# Altium schematic sheet Connectors.SchDoc
size B; Organization: VITRONIC Dr.-Ing. Stein Bildverarbeitungssysteme GmbH; Address1: Hasengartenstrasse 14; Address2: D-65189 Wiesbaden; Address3: Phone: 49/611/7152-0; Address4: Fax:     49/611/7152-133; SheetNumber: 1; SheetTotal: 3
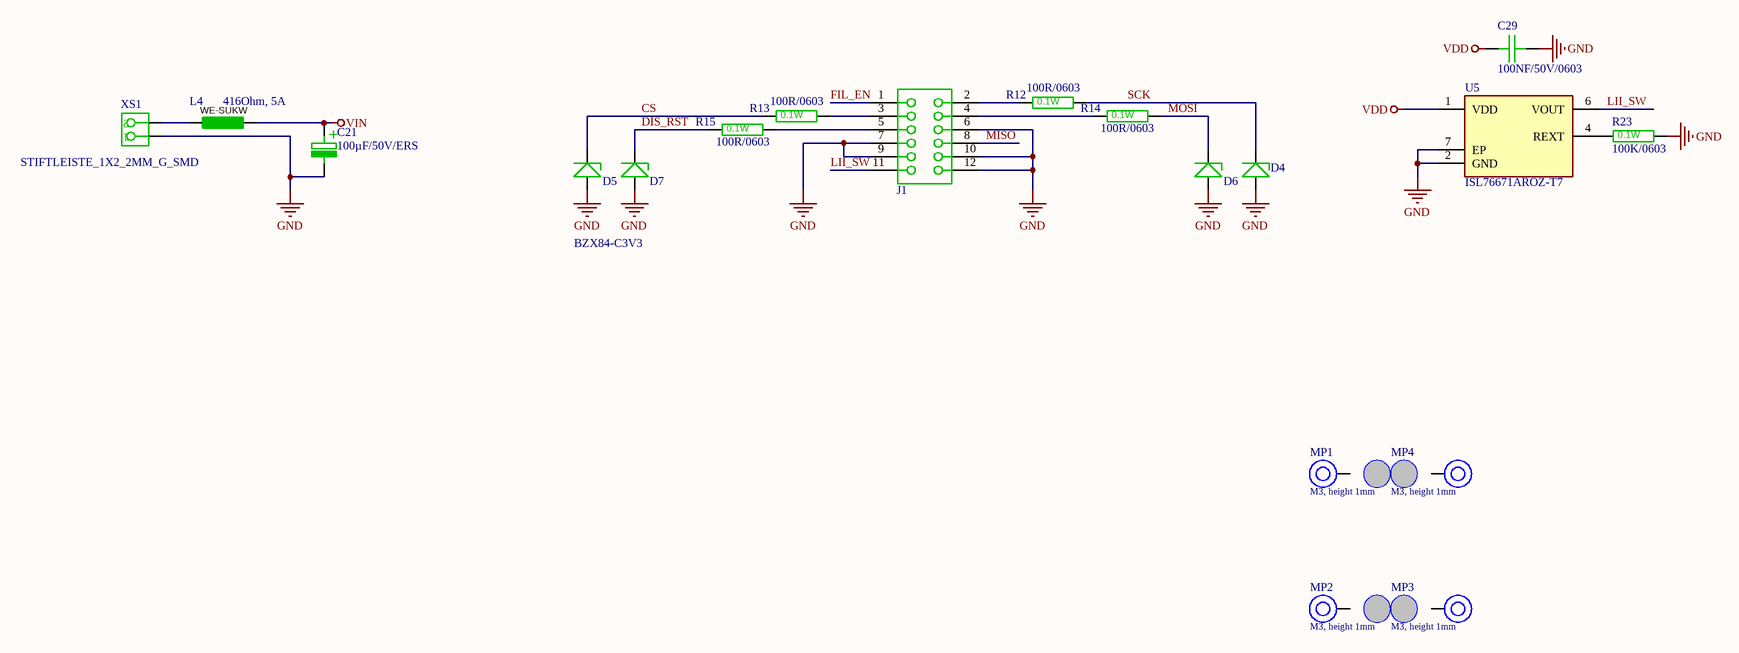
[diagram p0: Connectors.SchDoc]

## Parts
C21  100µF/50V/ERS  [AL-ERS8x8__R]
C29  100NF/50V/0603  [0603__R]
D4  BZX84-C3V3  [SOT-23-3__R]
D5  BZX84-C3V3  [SOT-23-3__R]  (value not drawn)
D6  BZX84-C3V3  [SOT-23-3__R]  (value not drawn)
D7  BZX84-C3V3  [SOT-23-3__R]  (value not drawn)
J1  490107671212  [490107671212_Permanent Application]  (value not drawn)
L4  416Ohm, 5A  [7427511_WE-SUKW__R]
MP1  M3, height 1mm  [9774010360_R]
MP2  M3, height 1mm  [9774010360_R]
MP3  M3, height 1mm  [9774010360_R]
MP4  M3, height 1mm  [9774010360_R]
R12  100R/0603  [0603__R]
R13  100R/0603  [0603__R]
R14  100R/0603  [0603__R]
R15  100R/0603  [0603__R]
R23  100K/0603  [0603__R]
U5  ISL76671AROZ-T7  [SON65P210X200X80-7N]
XS1  STIFTLEISTE_1X2_2MM_G_SMD  [1X2POL-2mm-G__R]

## Nets
GND: C21.1 C29.1 D4.1 D5.1 D6.1 D7.1 J1.6 J1.7 J1.9 J1.10 J1.12 R23.2 U5.2(GND) U5.7(EP) XS1.1
VDD: C29.2 U5.1(VDD)
VIN: C21.2 L4.2
CS: D5.3 R13.1
DIS_RST: D7.3 R15.1
FIL_EN: J1.1
LII_SW: J1.11 U5.6(VOUT)
MISO: J1.8
MOSI: D6.3 R14.2
SCK: D4.3 R12.2
NetJ1_2: J1.2 R12.1
NetJ1_3: J1.3 R13.2
NetJ1_4: J1.4 R14.1
NetJ1_5: J1.5 R15.2
NetL4_1: L4.1 XS1.2
NetR23_1: R23.1 U5.4(REXT)

Not connected (* = marked no-connect by the designer): MP1 1; MP2 1; MP3 1; MP4 1; U5 3(NC_1) 5(NC_2)

## Notes on the sheet
- Bearbeiter
- Datum
- Titel:
- Erstellt
- Bearbeitet
- Geprüft
- Größe:
- B
- Nummer
- Revision:
- Status
- Seite
- von
- (in symbol 100R/0603) 0.1W
- (in symbol 100µF/50V/ERS) +
- (in symbol 7427511) WE-SUKW

## Library data of the parts
C21 = 100µF/50V/ERS: Capacitor, 100µF, Low ESR, 105 °C, 50V, 20%, Al-Elektrolyt, SMD, Größe ERS8x8; Text Field1: 80894; Text Field4: 100µF/ERS Low ESR; Text Field2: SMD; Text Field3: Größe ERS8x8; Text Field5: 50V; Text Field6: 20%; Text Field7: Al-Elektrolyt
C29 = 100NF/50V/0603: Capacitor, 100nF, 50V, 10%, Ceramic XR7, SMD, 0603; Manufacturer: KEMET; Manufacturer Part Number: C0603X104K5RACTU; Text Field1: 113024; Text Field7: 0603, 50V, ±10%, X7R; Kapazitätswert: 0.1; Dielektrische Charakteristik: X7R; Nennspannung: 50; Kondensatorgehäusestil: 0603 [1608 Metric]; Betriebstemperaturbereich: -55°C bis +125; SVHC: No SVHC (18-Jun-2012); Anschlusstyp: Surface Mount (SMD, SMT); Breite/Weite: 0.8; Gehäusetyp: 0603; Länge/Höhe, Außen-: 1.6; Min Betriebstemperatur: -55; Pin, Anzahl der: 2; Serie: FT; Temperatur, Betriebs- max.: 125; Supplier 1: Farnell; RoHS: YES; Stock 1: 97613; Pricing 1: 10=0,084, 100=0,042, 500=0,029, 1000=0,021, 4000=0,016 (EUR); Kapazitätstoleranz: ± 10%; Capacitor Terminals: SMD; Tiefe, Außen: 0.8; Toleranz +: 10%; Toleranz -: 10%; VDC Nennspannung: 50; ComponentLink1URL: http://www.farnell.com/datasheets/75233.pdf; ComponentLink1Description: http://www.farnell.com/datasheets/75233.pdf; ComponentLink2URL: http://www.farnell.com/cad/1558668.zip; ComponentLink2Description: http://www.farnell.com/cad/1558668.zip; Supplier Part Number 1: 1414028
D4-D7 = BZX84-C3V3: DIODE ZENER 3.3V 250MW SOT23; Manufacturer: Nexperia USA Inc.; Manufacturer Part Number: BZX84-C3V3,215; Tolerance: ±5%; Current - Reverse Leakage @ Vr: 5µA @ 1V; Voltage - Forward (Vf) (Max) @ If: 900mV @ 10mA; Text Field1: 139997; Text Field7: Nexperia: BZX84-C3V3,215; Supplier 1: Digi-Key; RoHS: RoHS Compliant; Category: Discrete Semiconductor Products; Stock 1: 0; Pricing 1: 3000=0.02273, 6000=0.0205, 15000=0.01782, 30000=0.01604, 75000=0.01426, 150000=0.01185 (EUR); Packaging: Tape & Reel (TR); Part Status: Active; Power - Max: 250mW; Operating Temperature: -65°C ~ 150°C; Mounting Type: Surface Mount; Package / Case: TO-236-3, SC-59, SOT-23-3; Supplier Device Package: TO-236AB (SOT23); ComponentLink1URL: http://assets.nexperia.com/documents/data-sheet/BZX84_SER.pdf; ComponentLink1Description: http://assets.nexperia.com/documents/data-sheet/BZX84_SER.pdf; Supplier Part Number 1: 1727-2937-2-ND
J1 = 490107671212: WR-WST REDFIT IDC SKEDD, pitch 2.54mm, 12p; Manufacturer: Wurth Elektronik; Contact Resistance: 10mΩ; Gender: Transition; Rated Current: 1A; Working Voltage: 100VAC; ComponentLink1Description: Website Link; ComponentLink1URL: https://www.we-online.com/redexpert/article/490107671212?ad; ComponentLink2Description: Datasheet Link; ComponentLink2URL: https://www.we-online.com/redexpert/spec/490107671212?ad; Manufacturer Part Number: 490107671212; Category: Wire-to-Board Connectors; Match Code: WR-WST; Mount: Press Fit; Operating Temperature Max: 105°C; Operating Temperature Min: -25°C; Packaging: Tube; Number of Pins: 12; Pitch: 2.54mm
L4 = 7427511: WE-SUKW SMT EMI Suppression 5-Hole Ferrite Bead, , 416Ohm, 5A; Manufacturer: Wurth Elektronik; Impedance max.: 440Ohm; Impedance @25MHz: 272Ohm; DC Resistance max.: 11mOhm; Impedance max. Test Condition: 100MHz; Text Field1: 156774; Text Field7: Würth: 7427511; ComponentLink1Description: Manufacturer; ComponentLink1URL: http://www.we-online.de; ComponentLink2Description: Datasheet; ComponentLink2URL: https://www.we-online.com/catalog/datasheet/7427511.pdf; Manufacturer Part Number: 7427511; Mounting Technology: SMT; Height: 4.6mm; Length: 8mm; Impedance @100MHz: 416Ohm; Packaging: Tape and Reel; Operating Temperature: -40 to +125degC; Rated Current: 5A; Published Date: April 2020; Width: 5mm
MP1-MP4 = 9774010360: SMT Steel Spacer with internal Thread M3 WA-SMSI, height 1mm; Manufacturer: Wurth Electronics; Tightening Torque: 0.5 Nm; Solder Cream Thickness: 150 um; Surface: Tin; Text Field1: 148883; Text Field7: Würth: 9774010360; ComponentLink1Description: Manufacturer; ComponentLink1URL: http://www.we-online.de; ComponentLink2Description: Datasheet; ComponentLink2URL: https://katalog.we-online.de/em/datasheet/9774010360.pdf; Part Number: 9774010360; Published Date: November 2018; Publisher: Wurth Elektronik; Operating Temperature: -55 to 150 degC; Packaging: Bulk; Material: Steel; Mounting Technology: SMT; Thread: M3; Manufacturer Part Number: 9774010360; Stock: 200; Supplier 1: Mouser; Supplier Part Number 1: 710-9774010360; Pricing 1: 1=2.54, 10=2.41, 50=2.28, 100=2.11, 1000=2.11, 10000=2.11 (USD)
R12-R15 = 100R/0603: Resistor, 100R, 0.1W, 1%, TK50, Metallschicht, SMD, 0603; Text Field1: 67270; Text Field7: 0603, 0,1 W, 1,0 %, TK50
R23 = 100K/0603: Resistor, 100K, 0.1W, 1%, TK50, Metallschicht, SMD, 0603; Text Field1: 70755; Text Field3: 0603; Text Field7: 0603, 0,1 W, 1,0 %, TK50; Text Field8: 4; Text Field2: SMD; Text Field4: 100K; Text Field5: 0.1W; Text Field6: 1%, TK50
U5 = ISL76671AROZ-T7: Light to Analog Sensors (Voltage) Low Power, <100 Lux Optimized, Analog Output Ambient Light Sensor; Manufacturer_Name: Renesas Electronics; Geometry.Height: 0.8mm; Mouser Part Number: 968-ISL76671AROZ-T7; Mouser Price/Stock: https://www.mouser.co.uk/ProductDetail/Renesas-Intersil/ISL76671AROZ-T7?qs=9fLuogzTs8KH%2F0coQfRtPw%3D%3D; Manufacturer_Part_Number: ISL76671AROZ-T7; Datasheet Link: https://www.renesas.com/en-us/www/doc/datasheet/isl76671.pdf
XS1 = STIFTLEISTE_1X2_2MM_G_SMD: Manufacturer: JST Sales America Inc; Manufacturer Part Number: B2B-PH-SM4-TB(LF)(SN); Text Field1: 121631; Text Field7: JST: B2B-PH-SM4-TB(LF)(SN); Connector Type: Header, Shrouded; Number of Positions: 2; Number of Positions Loaded: All; Pitch: 0.079" (2.00mm); Supplier 1: Digi-Key; RoHS: RoHS Compliant; Category: Connectors, Interconnects; Pricing 1: 1=0.41, 10=0.38, 50=0.3038, 100=0.291, 250=0.26576, 500=0.25308 (EUR); Packaging: Cut Tape (CT); Contact Type: Male Pin; Number of Rows: 1; Mounting Type: Surface Mount; Termination: Solder; Features: Solder Retention; Contact Finish: Tin; Color: Natural; ComponentLink1URL: http://www.jst-mfg.com/product/pdf/eng/ePH.pdf; ComponentLink1Description: http://www.jst-mfg.com/product/pdf/eng/ePH.pdf; Supplier Part Number 1: 455-1734-1-ND